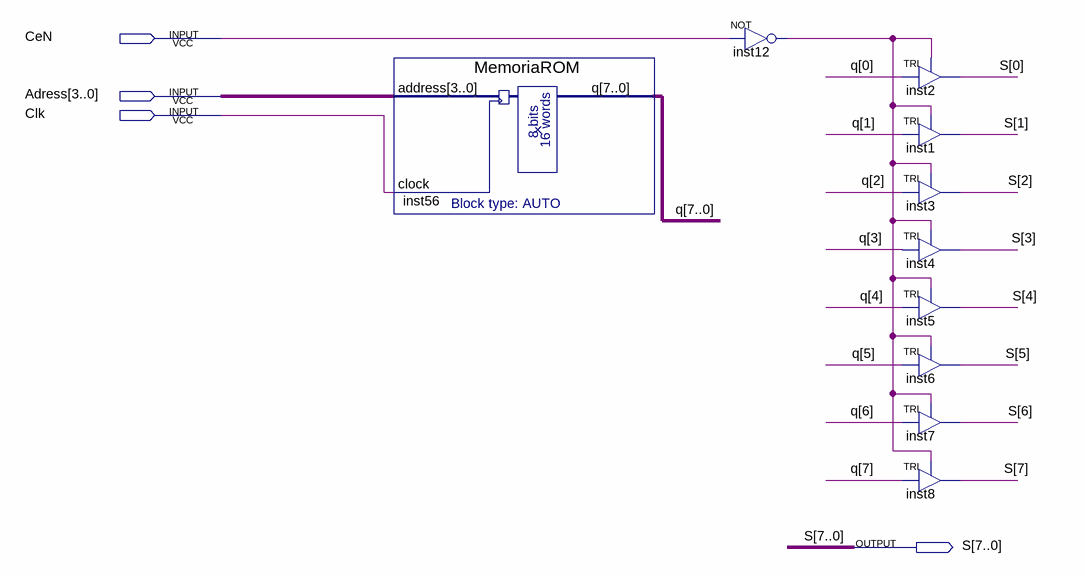
[diagram p0: schematic sheet]
// Quartus schematic Memoria_ta_bugada.bdf as structural Verilog: 10 symbols, 4 pins
module Memoria_ta_bugada (
  input  CeN,
  input  [3:0] Adress,
  input  Clk,
  output [7:0] S
);

  wire inst12_out;
  wire [7:0] q;

  MemoriaROM inst56 (.address(Adress), .clock(Clk), .q(q));
  not inst12 (inst12_out, CeN);
  TRI inst2 (.IN(q[0]), .OE(inst12_out), .OUT(S[0]));
  TRI inst1 (.IN(q[1]), .OE(inst12_out), .OUT(S[1]));
  TRI inst3 (.IN(q[2]), .OE(inst12_out), .OUT(S[2]));
  TRI inst4 (.IN(q[3]), .OE(inst12_out), .OUT(S[3]));
  TRI inst5 (.IN(q[4]), .OE(inst12_out), .OUT(S[4]));
  TRI inst6 (.IN(q[5]), .OE(inst12_out), .OUT(S[5]));
  TRI inst7 (.IN(q[6]), .OE(inst12_out), .OUT(S[6]));
  TRI inst8 (.IN(q[7]), .OE(inst12_out), .OUT(S[7]));
endmodule
